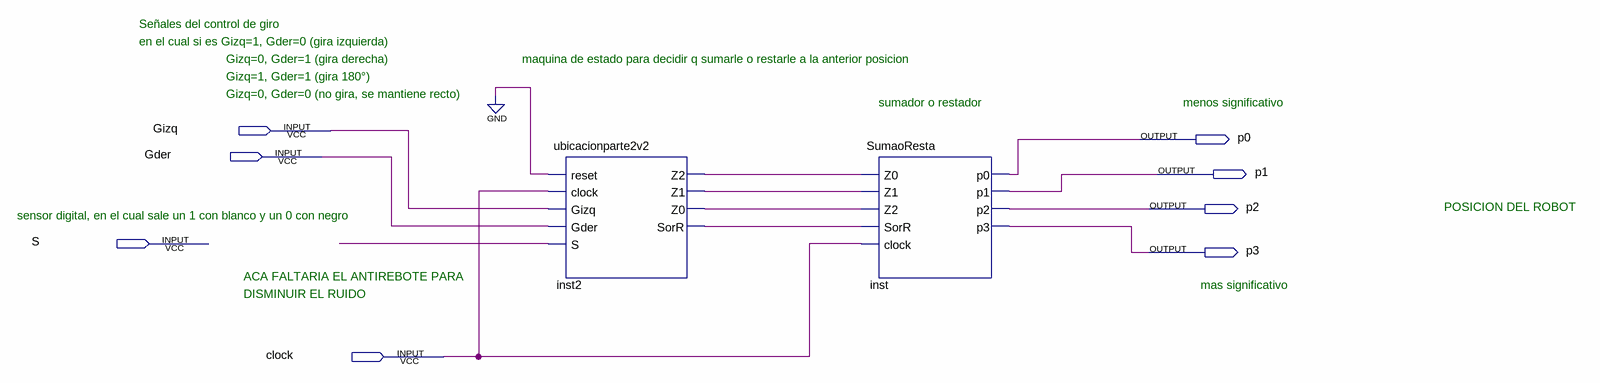
[diagram p0: schematic sheet]
// Quartus schematic ESQUEMATICO_DE_UBICACION.bdf as structural Verilog: 2 symbols, 8 pins
module ESQUEMATICO_DE_UBICACION (
  input  Gizq,
  input  Gder,
  input  S,
  input  clock,
  output p0,
  output p1,
  output p2,
  output p3
);

  wire inst2_sorr, inst2_z0, inst2_z1, inst2_z2, undriven;

  ubicacionparte2v2 inst2 (
    .reset(1'b0), .clock(clock), .Gizq(Gizq), .Gder(Gder), .S(undriven), .Z2(inst2_z2), .Z1(inst2_z1),
    .Z0(inst2_z0), .SorR(inst2_sorr));
  SumaoResta inst (
    .Z0(inst2_z2), .Z1(inst2_z1), .Z2(inst2_z0), .SorR(inst2_sorr), .clock(clock), .p0(p0), .p1(p1), .p2(p2),
    .p3(p3));

  // Notes on the sheet:
  //   Señales del control de giro
  //   en el cual si es Gizq=1, Gder=0 (gira izquierda)
  //   Gizq=0, Gder=1 (gira derecha)
  //   maquina de estado para decidir q sumarle o restarle a la anterior posicion 
  //   Gizq=1, Gder=1 (gira 180°)
  //   Gizq=0, Gder=0 (no gira, se mantiene recto)
  //   sumador o restador
  //   menos significativo
  //   POSICION DEL ROBOT
  //   sensor digital, en el cual sale un 1 con blanco y un 0 con negro
  //   ACA FALTARIA EL ANTIREBOTE PARA
  //   mas significativo
  //   DISMINUIR EL RUIDO
endmodule
